# Altium schematic sheet PCB_PowerBtn.SchDoc
size A
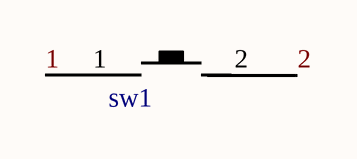
[diagram p0: PCB_PowerBtn.SchDoc]

## Parts
sw1  tactile_switch_power  [tactile_switch_power]  (value not drawn)

## Nets
1: sw1.1
2: sw1.2